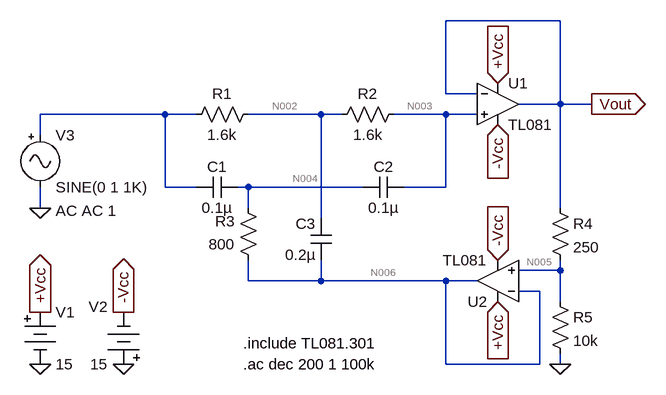
[diagram p0: schematic Bootstrapped (Active) Twin-T.asc]
Bootstrapped (Active) Twin-T.asc, the LTspice schematic file:
Version 4
SHEET 1 880 680
WIRE 240 -80 64 -80
WIRE 64 32 64 -80
WIRE 112 32 64 32
WIRE 240 48 240 -80
WIRE 240 48 176 48
WIRE 288 48 240 48
WIRE -368 64 -560 64
WIRE -320 64 -368 64
WIRE -128 64 -240 64
WIRE -96 64 -128 64
WIRE 64 64 -16 64
WIRE 112 64 64 64
WIRE -560 96 -560 64
WIRE -368 176 -368 64
WIRE -320 176 -368 176
WIRE -240 176 -256 176
WIRE -64 176 -240 176
WIRE 64 176 64 64
WIRE 64 176 0 176
WIRE -560 208 -560 176
WIRE -240 208 -240 176
WIRE 240 208 240 48
WIRE -128 224 -128 64
WIRE 240 304 240 288
WIRE 240 304 176 304
WIRE -240 320 -240 288
WIRE -128 320 -128 288
WIRE -128 320 -240 320
WIRE 64 320 -128 320
WIRE 112 320 64 320
WIRE 208 336 176 336
WIRE 240 352 240 304
WIRE 64 448 64 320
WIRE 208 448 208 336
WIRE 208 448 64 448
WIRE 240 448 240 432
FLAG 240 448 0
FLAG 288 48 Vout
IOPIN 288 48 Out
FLAG 144 16 +Vcc
IOPIN 144 16 In
FLAG 144 80 -Vcc
IOPIN 144 80 In
FLAG -560 368 +Vcc
IOPIN -560 368 Out
FLAG -432 368 -Vcc
IOPIN -432 368 Out
FLAG -560 448 0
FLAG -432 448 0
FLAG -560 208 0
FLAG 144 352 +Vcc
IOPIN 144 352 In
FLAG 144 288 -Vcc
IOPIN 144 288 In
SYMBOL OpAmps\\opamp2 144 -16 R0
SYMATTR InstName U1
SYMATTR Value TL081
SYMBOL res -224 48 R90
WINDOW 0 0 56 VBottom 2
WINDOW 3 32 56 VTop 2
SYMATTR InstName R1
SYMATTR Value 1.6k
SYMBOL cap 0 160 R90
WINDOW 0 0 32 VBottom 2
WINDOW 3 32 32 VTop 2
SYMATTR InstName C2
SYMATTR Value 0.1µ
SYMBOL cap -112 288 R180
WINDOW 0 24 56 Left 2
WINDOW 3 24 8 Left 2
SYMATTR InstName C3
SYMATTR Value 0.2µ
SYMBOL res -224 304 R180
WINDOW 0 36 76 Left 2
WINDOW 3 36 40 Left 2
SYMATTR InstName R3
SYMATTR Value 800
SYMBOL res 224 192 R0
SYMATTR InstName R4
SYMATTR Value 250
SYMBOL res 224 336 R0
SYMATTR InstName R5
SYMATTR Value 10k
SYMBOL cap -256 160 R90
WINDOW 0 0 32 VBottom 2
WINDOW 3 32 32 VTop 2
SYMATTR InstName C1
SYMATTR Value 0.1µ
SYMBOL res 0 48 R90
WINDOW 0 0 56 VBottom 2
WINDOW 3 32 56 VTop 2
SYMATTR InstName R2
SYMATTR Value 1.6k
SYMBOL Misc\\battery -560 352 R0
WINDOW 123 0 0 Left 0
WINDOW 39 0 0 Left 0
SYMATTR InstName V1
SYMATTR Value 15
SYMBOL Misc\\battery -432 464 R180
WINDOW 0 24 104 Left 2
WINDOW 3 24 16 Left 2
WINDOW 123 0 0 Left 0
WINDOW 39 0 0 Left 0
SYMATTR InstName V2
SYMATTR Value 15
SYMBOL Misc\\signal -560 80 R0
WINDOW 123 24 132 Left 2
WINDOW 39 0 0 Left 0
SYMATTR Value2 AC AC 1
SYMATTR InstName V3
SYMBOL OpAmps\\opamp2 144 384 R180
SYMATTR InstName U2
SYMATTR Value TL081
TEXT -248 416 Left 2 !.include TL081.301
TEXT -248 448 Left 2 !.ac dec 200 1 100k

The netlist it stands for:
* Bootstrapped (Active) Twin-T.asc
XU1 N003 Vout +Vcc -Vcc Vout TL081  ; pins In+ In- V+ V- OUT
R1 N002 N001 1.6k
C2 N003 N004 0.1µ
C3 N006 N002 0.2µ
R3 N006 N004 800
R4 Vout N005 250
R5 N005 0 10k
C1 N004 N001 0.1µ
R2 N003 N002 1.6k
V1 +Vcc 0 15
V2 0 -Vcc 15
V3 N001 0 SINE(0 1 1K) AC AC 1
XU2 N005 N006 +Vcc -Vcc N006 TL081  ; pins In+ In- V+ V- OUT
.include TL081.301
.ac dec 200 1 100k
.backanno
.end

* Results of the author's LTspice run, read from the files saved beside the schematic
* Operating Point, zero values left out:
*   V(vout) = 10.83 µV
*   V(-vcc) = -15 V
*   V(+vcc) = 15 V
*   V(n003) = -144.2 nV
*   V(n002) = -72.09 nV
*   V(n004) = 21.52 µV
*   V(n006) = 21.52 µV
*   V(n005) = 10.55 µV
*   I(R1) = -45.05 pA
*   I(R4) = 1.1 nA
*   I(R5) = 1.055 nA
*   I(R2) = -45.05 pA
*   I(V1) = -28.39 mA
*   I(V2) = -28.39 mA
*   I(V3) = -45.05 pA
*   Ix(u1:1) = 45.05 pA
*   Ix(u1:2) = 45.05 pA
*   Ix(u1:3) = 14.19 mA
*   Ix(u1:4) = -14.19 mA
*   Ix(u1:5) = -1.145 nA
*   Ix(u2:1) = 45.05 pA
*   Ix(u2:2) = 45.05 pA
*   Ix(u2:3) = 14.19 mA
*   Ix(u2:4) = -14.19 mA
*   Ix(u2:5) = -45.05 pA
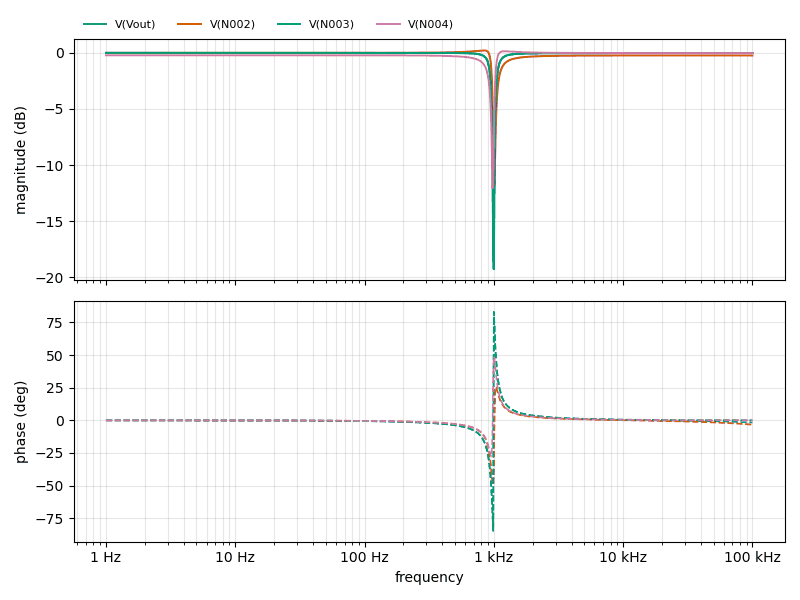
[diagram p1: AC Analysis of Bootstrapped (Active) Twin-T.asc, plotted from the saved traces]
* AC Analysis, 1 run:
*   V(Vout): -0.00 dB at 1 Hz, -0.02 dB at 100 kHz, peak -0.00 dB at 1 Hz, 3 dB below the peak at 947.6 Hz
*   V(N002): 0.00 dB at 1 Hz, -0.23 dB at 100 kHz, peak 0.22 dB at 841.4 Hz, 3 dB below the peak at 968.4 Hz
*   V(N003): -0.00 dB at 1 Hz, -0.02 dB at 100 kHz, peak -0.00 dB at 1 Hz, 3 dB below the peak at 947.6 Hz
*   V(N004): -0.22 dB at 1 Hz, -0.01 dB at 100 kHz, peak 0.14 dB at 1.216 kHz, 3 dB below the peak at 1.022 kHz